# EAGLE design HID-Bridge-ATmega_proto (EAGLE 6.5.0)
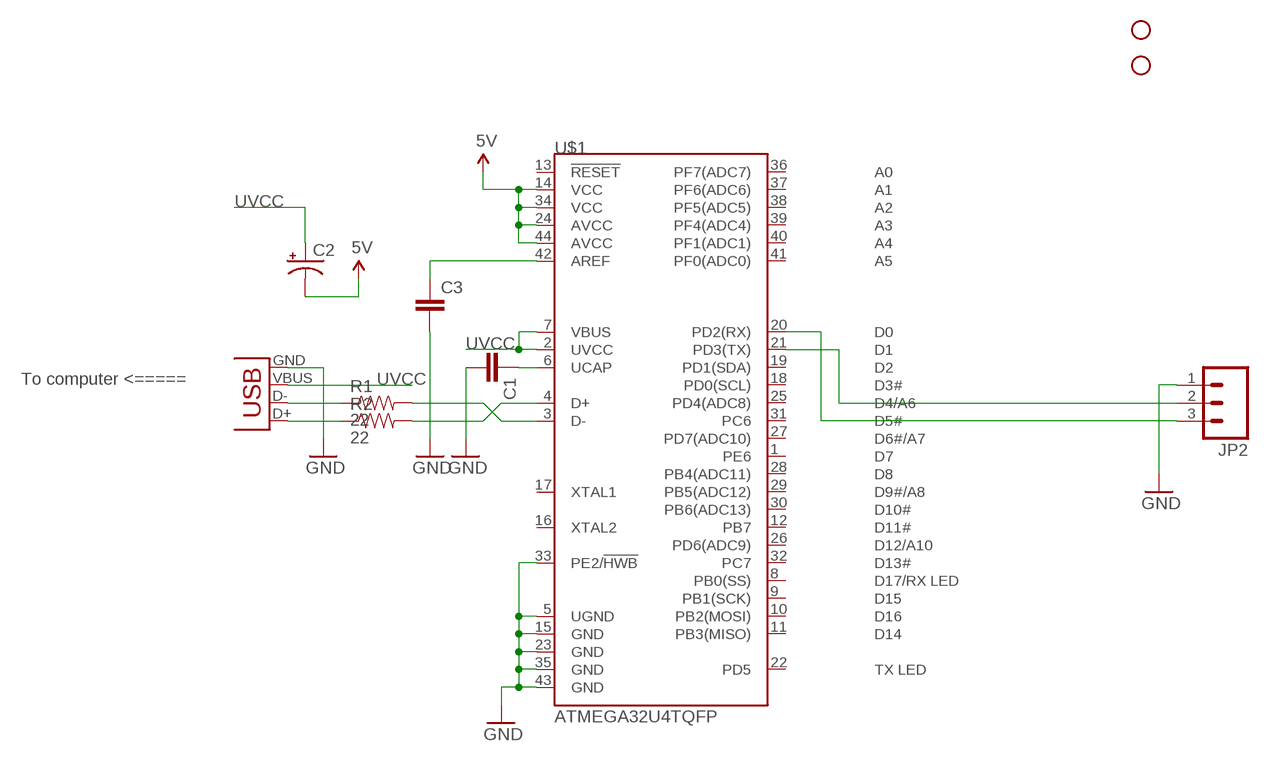
[diagram p0: schematic, sheet 1]

## Parts
C1  CAPPTH  [CAP-PTH-SMALL]
C2  10UF-25V-20%(PTH)  [CPOL-RADIAL-10UF-25V]
C3  CAPPTH  [CAP-PTH-SMALL]
JP1  USB-B  USBPTH  [USB-B-PTH]
JP2  M03PTH  [1X03]
R1  22  RESISTORPTH-1/4W-VERT  [AXIAL-0.1]
R2  22  RESISTORPTH-1/4W-VERT  [AXIAL-0.1]
STANDOFF1  STAND-OFF  [STAND-OFF]
STANDOFF2  STAND-OFF  [STAND-OFF]
U$1  ATMEGA32U4TQFP  [SPARKFUN-DIGITALIC_TQFP44]

## Nets
5V: C2.2(-) U$1.14(VCC) U$1.24(AVCC) U$1.34(VCC) U$1.44(AVCC)
GND: C1.2 C3.2 JP1.GND JP2.1 U$1.5(UGND) U$1.15(GND) U$1.23(GND) U$1.33(PE2/!HWB) U$1.35(GND) U$1.43(GND)
N$1: JP1.D- R1.P$1
N$2: JP1.D+ R2.P$1
N$3: R1.P$2 U$1.3(D-)
N$4: R2.P$2 U$1.4(D+)
N$5: C1.1 U$1.6(UCAP)
N$6: C3.1 U$1.42(AREF)
N$7: JP2.3 U$1.20(PD2(RX))
N$8: JP2.2 U$1.21(PD3(TX))
UVCC: C2.1(+) JP1.VBUS U$1.2(UVCC) U$1.7(VBUS)
Unconnected: U$1.1(PE6) U$1.8(PB0(SS)) U$1.9(PB1(SCK)) U$1.10(PB2(MOSI)) U$1.11(PB3(MISO)) U$1.12(PB7) U$1.13(!RESET) U$1.16(XTAL2) U$1.17(XTAL1) U$1.18(PD0(SCL)) U$1.19(PD1(SDA)) U$1.22(PD5) U$1.25(PD4(ADC8)) U$1.26(PD6(ADC9)) U$1.27(PD7(ADC10)) U$1.28(PB4(ADC11)) U$1.29(PB5(ADC12)) U$1.30(PB6(ADC13)) U$1.31(PC6) U$1.32(PC7) U$1.36(PF7(ADC7)) U$1.37(PF6(ADC6)) U$1.38(PF5(ADC5)) U$1.39(PF4(ADC4)) U$1.40(PF1(ADC1)) U$1.41(PF0(ADC0))

## Notes on the sheet
- To computer <=====

## Library data of the parts
C1 C3 = SparkFun-Capacitors:CAP: Capacitor Standard 0603 ceramic capacitor, and 0.1" leaded capacitor.
C2 = SparkFun-Capacitors:10UF-25V-20%(PTH): CAP-08440; PROD_ID: CAP-08440
JP1 = SparkFun-Connectors:USB: USB Connectors USB-B-PTH is fully proven SKU : PRT-00139/CONN-08278 USB-miniB is fully proven SKU : PRT-00587 USB-A-PCB is untested. USB-A-H is throughly reviewed, but untested. Spark Fun Electronics SKU : PRT-00437 USB-B-SMT is throughly reviewed, but untested. Needs silkscreen touching up. USB-A-S has not been used/tested USB-MB-H has not been used/tested USB-MICROB has been used. CONN-09505; PROD_ID: CONN-08278
JP2 = SparkFun-Connectors:M03: Header 3 Standard 3-pin 0.1" header. Use with straight break away headers (SKU : PRT-00116), right angle break away headers (PRT-00553), swiss pins (PRT-00743), machine pins (PRT-00117), and female headers (PRT-00115). Molex polarized connector foot print use with SKU : PRT-08232 with associated crimp pins and housings.
R1 R2 = SparkFun-Resistors:RESISTOR: Resistor Basic schematic elements and footprints for 0603, 1206, and PTH resistors.
STANDOFF1 STANDOFF2 = SparkFun-Electromechanical:STAND-OFF: #4 Stand Off This is the mechanical footprint for a #4 phillips button head screw. Use the keepout ring to avoid running the screw head into surrounding components. SKU : PRT-00447
U$1 = SparkFun-DigitalIC:ATMEGA32U4: Atmel 44-pin 8-bit Microcontroller with 32KBytes of ISP Flash and USB Controller ----- Please use the QFN-44-NOPAD_1:1 package for the footprint of all boards using a 32U4. Route traces directly away from the pads as much as possible.; PROD_ID: IC-11161

## Board
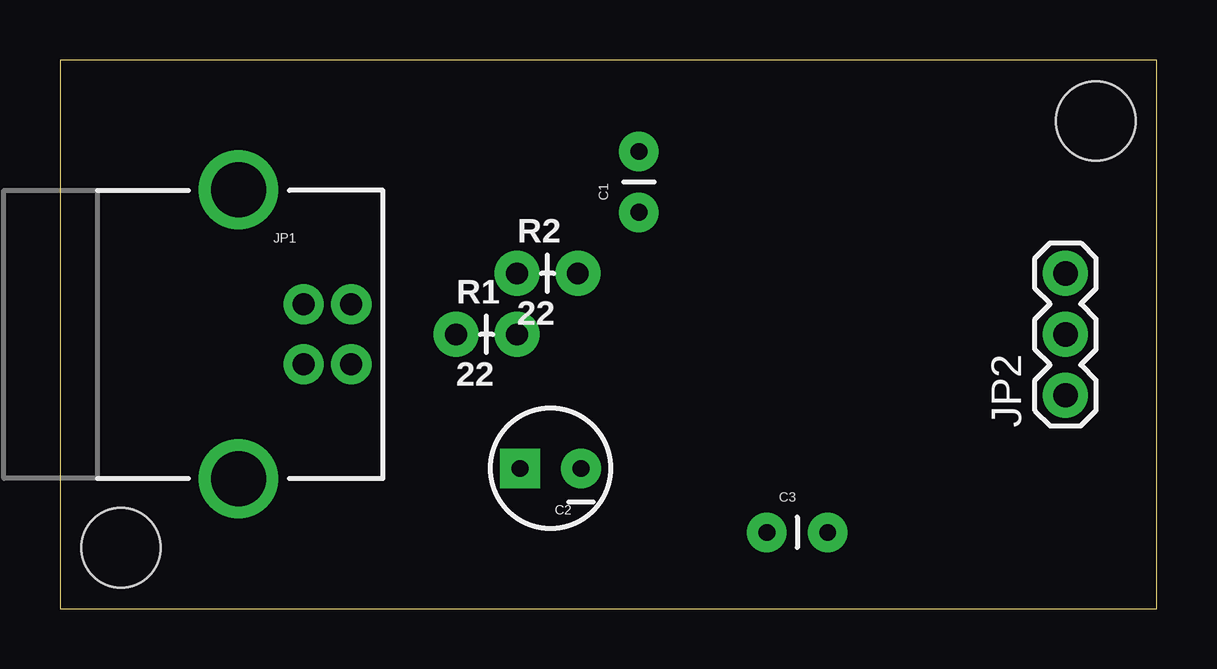
[diagram p1: board, top side]
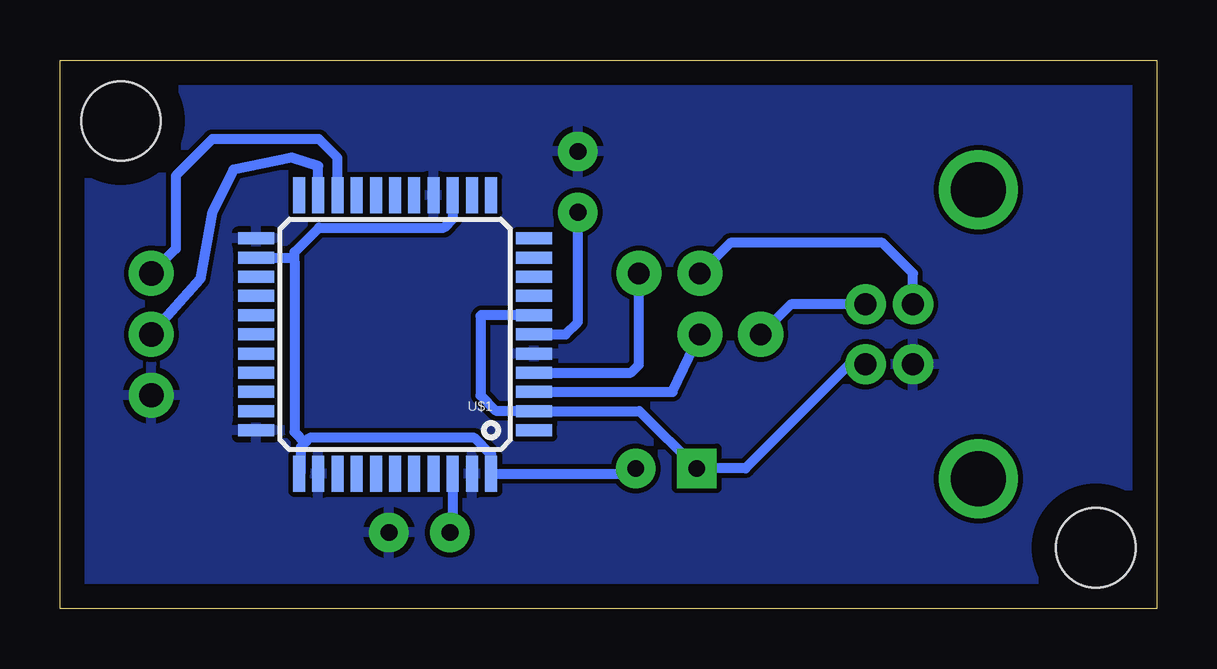
[diagram p2: board, bottom side, seen from below]

Size 45.72 x 22.86 mm. Coordinates in mm from the lower left corner, seen from the top.
Outline: 0,0 45.72,0 45.72,22.86 0,22.86 0,0
Copper layers (1*16): Top 0.035mm / dielectric 1.5mm / Bottom 0.035mm
Design rules "default": minimum track width 10mil, minimum drill 24mil, track to track 8mil, track to pad 8mil, pad to pad 8mil, via to via 8mil, smd to smd 8mil, copper to edge 40mil, drill to drill 8mil, minimum pad ring 10mil, minimum via ring 8mil, stop-mask expansion 4mil, vias tented up to drill 0mil, thermal gap 10mil

### Footprints (pad centres in the part's own frame; a part is rotated, then mirrored left to right if it is on the bottom)
CAP-PTH-SMALL = drill 0.7 pad 1.651: 1 0,0; 2 2.54,0
CPOL-RADIAL-10UF-25V = drill 0.7 pad 1.651 square: 1 1.27,0 | drill 0.7 pad 1.651: 2 -1.27,0
USB-B-PTH = drill 0.914 pad 1.676: D+ 0,1.25; D- 1.981,1.25; GND 0,-1.25; VBUS 1.981,-1.25 | drill 2.286: S1 -2.718,-6.02; S2 -2.718,6.02
1X03 = drill 1.016 pad 1.88: 1 0,0; 2 2.54,0; 3 5.08,0
AXIAL-0.1 = drill 0.9 pad 1.88: P$1 0,0; P$2 2.54,0
STAND-OFF = hole 3.302: 0,0
SPARKFUN-DIGITALIC_TQFP44 = smd 1.5 x 0.5: 1 -5.8,4; 2 -5.8,3.2; 3 -5.8,2.4; 4 -5.8,1.6; 5 -5.8,0.8; 6 -5.8,0; 7 -5.8,-0.8; 8 -5.8,-1.6; 9 -5.8,-2.4; 10 -5.8,-3.2; 11 -5.8,-4; 23 5.8,-4; 24 5.8,-3.2; 25 5.8,-2.4; 26 5.8,-1.6; 27 5.8,-0.8; 28 5.8,0; 29 5.8,0.8; 30 5.8,1.6; 31 5.8,2.4; 32 5.8,3.2; 33 5.8,4 | smd 0.5 x 1.5: 12 -4,-5.8; 13 -3.2,-5.8; 14 -2.4,-5.8; 15 -1.6,-5.8; 16 -0.8,-5.8; 17 0,-5.8; 18 0.8,-5.8; 19 1.6,-5.8; 20 2.4,-5.8; 21 3.2,-5.8; 22 4,-5.8; 34 4,5.8; 35 3.2,5.8; 36 2.4,5.8; 37 1.6,5.8; 38 0.8,5.8; 39 0,5.8; 40 -0.8,5.8; 41 -1.6,5.8; 42 -2.4,5.8; 43 -3.2,5.8; 44 -4,5.8

### Placement (x,y rotation side)
C1  24.13,16.51 90 top
C2  20.45,5.84 180 top
C3  29.46,3.17 0 top
JP1  10.16,11.43 0 top
JP2  41.91,8.89 90 top
R1  16.51,11.43 0 top
R2  19.05,13.97 0 top
STANDOFF1  2.54,2.54 0 top
STANDOFF2  43.18,20.32 0 top
U$1  31.75,11.43 180 bottom

### Tracks (layer width: path | path; a pad name or v marks a point on that pad's centre or on a via)
5V
  Bottom 0.406: C2.2 21.93,5.63 U$1.44 27.75,6.41 28.45,7.11 35.31,7.11 35.5,6.92 | 35.5,6.92 35.69,6.73 35.69,5.69 U$1.34 | U$1.24 36.09,14.63 35.94,14.48 | 35.94,14.48 35.94,7.37 35.5,6.92 | 35.94,14.48 35.94,14.86 34.92,15.88 29.72,15.88 29.34,16.26 29.34,17.22 U$1.14
GND
  pour Bottom: 0,0 0,22.86 45.72,22.86 45.72,0
N$1
  Bottom 0.406: JP1.D- 15.26,12.68 R1.P$1
N$2
  Bottom 0.406: JP1.D+ 10.16,13.97 11.43,15.24 17.78,15.24 R2.P$1
N$3
  Bottom 0.406: U$1.3 20.18,9.03 R1.P$2
N$4
  Bottom 0.406: U$1.4 21.92,9.83 21.59,10.16 R2.P$2
N$5
  Bottom 0.406: U$1.6 24.64,11.43 24.13,11.94 C1.1
N$6
  Bottom 0.406: U$1.42 29.35,3.29 C3.1
N$7
  Bottom 0.406: U$1.20 34.15,18.78 34.92,19.56 39.37,19.56 40.89,18.03 40.89,14.99 JP2.3
N$8
  Bottom 0.406: U$1.21 34.95,18.44 36.07,18.8 38.48,18.29 39.37,16.51 39.88,13.72 JP2.2
UVCC
  Bottom 0.406: U$1.7 28.16,12.23 28.19,12.19 28.19,8.89 27.56,8.26 25.98,8.26 U$1.2 21.57,8.23 C2.1 17.14,5.84 12.81,10.18 JP1.VBUS